# EasyEDA Pro project head_control.eprj, schematic Schematic2
Board Name: Board2; Create Date: 2025-11-11; Page Name: P1; Project Name: head_control; Schematic Name: Schematic2; Update Date: 2025-11-11; Company: 嘉立创EDA; Page Size: A4; Version: V1.0
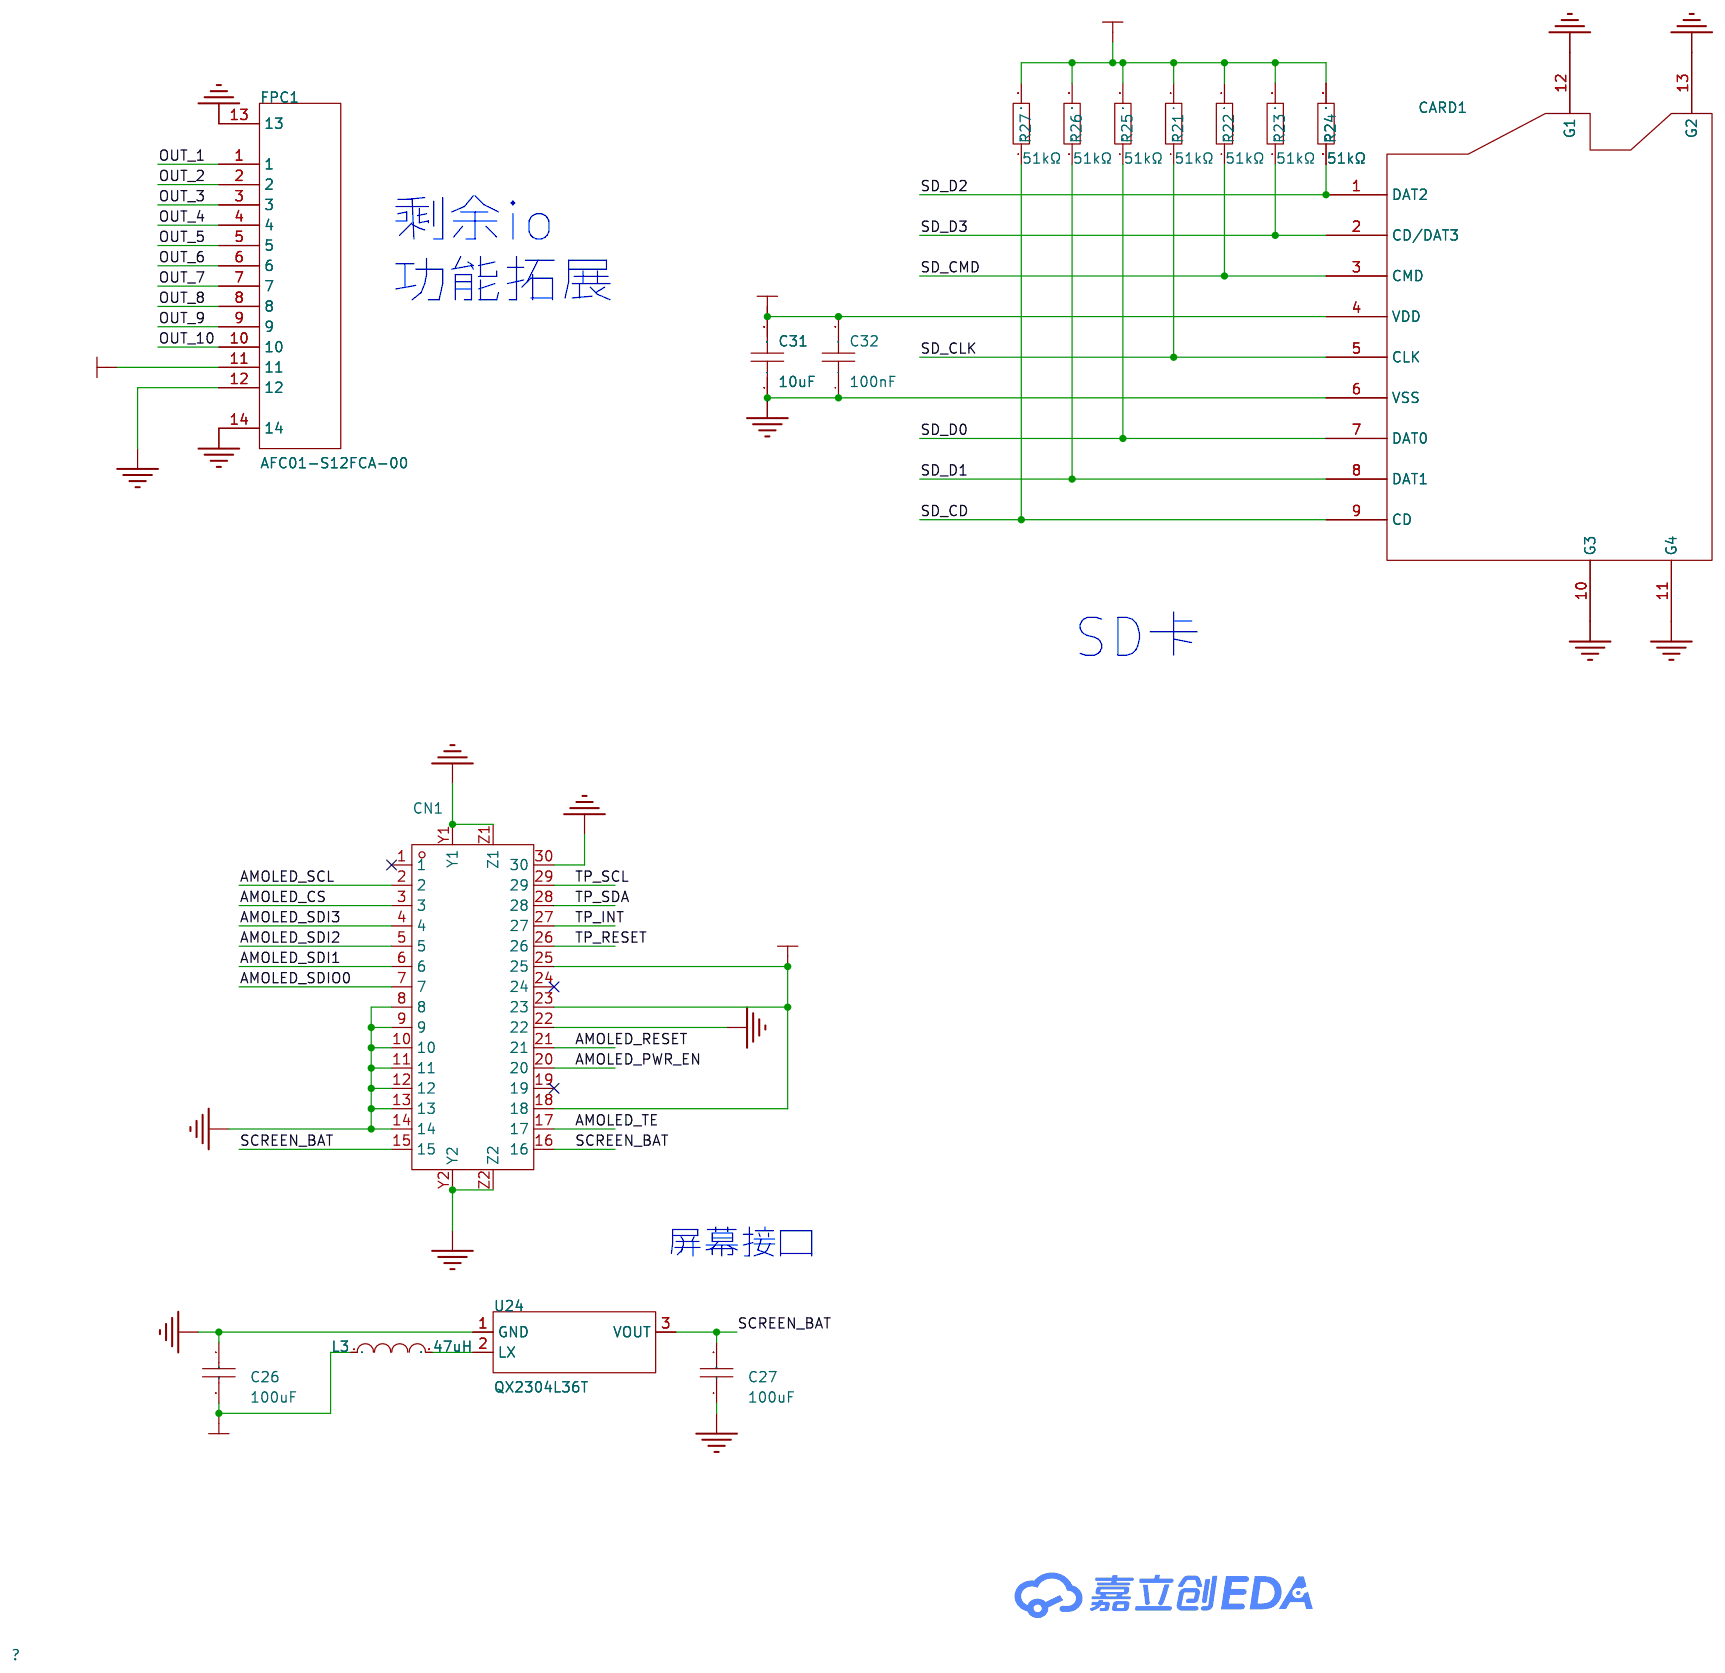
[diagram p1: schematic sheet]

## Parts
C26  100uF  [C0805]
C27  100uF  [C0805]
C31  10uF  [C0603]
C32  100nF  [C0603]
CARD1  TF-115Y-ACP9  [SIM-SMD_TF-115Y-BCP9]
CN1  AXE530127D  [CONN-SMD_30P-P0.40-AXE530127]
FPC1  AFC01-S12FCA-00  [FPC-SMD_AFC01-S12FCA-00]
L3  47uH  [IND-SMD_L4.0-W4.0_FNR40XXS]
R21  51kΩ  [R0603]
R22  51kΩ  [R0603]
R23  51kΩ  [R0603]
R24  51kΩ  [R0603]
R25  51kΩ  [R0603]
R26  51kΩ  [R0603]
R27  51kΩ  [R0603]
U24  QX2304L36T  [SOT-23-3_L2.9-W1.3-P1.90-LS2.4-BR]

## Library data of the parts
C26 C27 = GRM21BR60J107ME15L: LCSC Part Name: 100uF ±20% 6.3V; Supplier Part: C141660; Manufacturer: muRata(村田); Supplier Footprint: 0805; Datasheet: https://item.szlcsc.com/datasheet/GRM21BR60J107ME15L/152991.html; Supplier: LCSC; Tolerance: ±20%; Voltage Rating: 6.3V; Temperature Coefficient: X5R
C31 = CL10A106KP8NNNC: 容值:10uF;精度:±10%;额定电压:10V;材质(温度系数):X5R;; LCSC Part Name: 10uF ±10% 10V; Supplier Part: C19702; Manufacturer: SAMSUNG(三星); Supplier Footprint: 0603; JLCPCB Part Class: Basic Part; Datasheet: https://atta.szlcsc.com/upload/public/pdf/source/20160218/1457707763339.pdf; Supplier: LCSC; Tolerance: ±10%; Voltage Rated: 10V; Temperature Coefficient: X5R
C32 = CL10B104KB8NNNC: 容值:100nF;精度:±10%;额定电压:50V;材质(温度系数):X7R;; LCSC Part Name: 100nF ±10% 50V; Supplier Part: C1591; Manufacturer: SAMSUNG(三星); Supplier Footprint: 0603; JLCPCB Part Class: Extended Part; Datasheet: https://atta.szlcsc.com/upload/public/pdf/source/20160218/1457707763339.pdf; Supplier: LCSC; Tolerance: ±10%; Voltage Rated: 50V; Temperature Coefficient: X7R
CARD1 = TF-115Y-ACP9: 卡连接方式:自弹式;卡类型:MicroSD卡(TF卡);连接器类型:卡座;本体最大高度:-;工作温度范围:-25℃~+90℃;; LCSC Part Name: 自弹式 MicroSD卡(TF卡) 卡座; Supplier Part: C5454948; Manufacturer: XUNPU(讯普); Supplier Footprint: SMD; JLCPCB Part Class: Extended Part; Datasheet: https://atta.szlcsc.com/upload/public/pdf/source/20230427/4E99E1C1AE495F1492B014240EB95212.pdf; Supplier: LCSC; Card Connection Mode: 自弹式; Card Type: MicroSD卡(TF卡); Connector Type: 卡座; Additional Card Detection Pins: 有; Supplementary Features: 带定位柱; Operating Temperature Range: -25℃~+90℃
CN1 = AXE530127D: PIN总数:30P;间距:0.4mm;安装方式:立贴;排数:2;; LCSC Part Name: 间距:0.4mm PIN:30P 母 立贴; Supplier Part: C425103; Manufacturer: PANASONIC(松下); Supplier Footprint: SMD,P=0.4mm; JLCPCB Part Class: 扩展库; Datasheet: https://item.szlcsc.com/datasheet/AXE530127D/418588.html; Supplier: LCSC; Number of Pins: 30P; Pitch: 0.4mm; Mounting Type: 立贴; Number of Rows: 2
FPC1 = AFC01-S12FCA-00: LCSC Part Name: 间距:0.5mm P数:12P 翻盖式 下接; Supplier Part: C262661; Manufacturer: JS(钜硕电子); Supplier Footprint: SMD,P=0.5mm,卧贴; JLCPCB Part Class: 扩展库; Datasheet: https://item.szlcsc.com/datasheet/AFC01-S12FCA-00/253920.html; Supplier: LCSC; Locking Feature: 翻盖式; Contact Type: 下接; Number of Contacts: 12P; Pitch: 0.5mm; Mounting Type: 卧贴; FFC, FCB Thickness: 0.3mm; Height Above Board: 2mm
L3 = FNR4030S470MT: LCSC Part Name: 47uH ±20% 1A; Supplier Part: C167888; Manufacturer: cjiang(长江微电); Supplier Footprint: SMD,4x4mm; JLCPCB Part Class: 扩展库; Datasheet: https://atta.szlcsc.com/upload/public/pdf/source/20190327/C167925_9EFF0AABC4CA629C2CC95961DBF7D39D.pdf; Supplier: LCSC; Tolerance: ±20%; Current Rating: 800mA; Current - Saturation(Isat): 1A; DC Resistance(DCR): 579mΩ; Type: 磁胶屏蔽绕线合金电感
R21-R27 = RC0603FR-0751KL: 电阻类型:厚膜电阻;阻值:51kΩ;精度:±1%;功率:100mW;工作电压:75V;温度系数:±100ppm/℃;; LCSC Part Name: 厚膜电阻 51kΩ ±1% 100mW; Supplier Part: C107231; Manufacturer: YAGEO(国巨); Supplier Footprint: 0603; JLCPCB Part Class: 扩展库; Datasheet: https://atta.szlcsc.com/upload/public/pdf/source/20180821/C275644_0D56F95EFF785E7D9A1FEF436B37DA78.pdf; Supplier: LCSC; Type: 厚膜电阻; Tolerance: ±1%; Power(Watts): 100mW; Voltage-Supply(Max): 75V; Temperature Coefficient: ±100ppm/℃; Operating Temperature: -55℃~+155℃
U24 = QX2304L36T: LCSC Part Name: 高效 PFM 同步升压 DC/DC 变换器; Supplier Part: C219041; Manufacturer: 泉芯; Supplier Footprint: SOT-23; JLCPCB Part Class: 扩展库; Datasheet: https://item.szlcsc.com/datasheet/QX2304L36T/219906.html; Supplier: LCSC; Function: 升压型; Output Type: 固定; Voltage - Supply: 900mV~3.6V; Output Voltage: 3.6V; Output Current: 800mA; Frequency - Switching: 300kHz; Operating Temperature: -20℃~+85℃@(TA); Synchronous Rectifier: 是; Number of Outputs: 1; Topology: 升压式; Quiescent Current: 15uA; Switch tube (built-in/external): 内置

## Nets
3V3: C26.1 C31.2 C32.2 CARD1.4(VDD) CN1.18 CN1.23 CN1.25 FPC1.11 L3.1 R21.2 R22.2 R23.2 R24.2 R25.2 R26.2 R27.2
GND: C26.2 C27.1 C31.1 C32.1 CARD1.6(VSS) CARD1.10(G3) CARD1.11(G4) CARD1.12(G1) CARD1.13(G2) CN1.8 CN1.9 CN1.10 CN1.11 CN1.12 CN1.13 CN1.14 CN1.22 CN1.30 CN1.Y1 CN1.Y2 CN1.Z1 CN1.Z2 FPC1.12 FPC1.13 FPC1.14 U24.1(GND)
AMOLED_CS: CN1.3
AMOLED_PWR_EN: CN1.20
AMOLED_RESET: CN1.21
AMOLED_SCL: CN1.2
AMOLED_SDI1: CN1.6
AMOLED_SDI2: CN1.5
AMOLED_SDI3: CN1.4
AMOLED_SDIO0: CN1.7
AMOLED_TE: CN1.17
OUT_1: FPC1.1
OUT_2: FPC1.2
OUT_3: FPC1.3
OUT_4: FPC1.4
OUT_5: FPC1.5
OUT_6: FPC1.6
OUT_7: FPC1.7
OUT_8: FPC1.8
OUT_9: FPC1.9
OUT_10: FPC1.10
SCREEN_BAT: C27.2 CN1.15 CN1.16 U24.3(VOUT)
SD_CD: CARD1.9(CD) R27.1
SD_CLK: CARD1.5(CLK) R21.1
SD_CMD: CARD1.3(CMD) R22.1
SD_D0: CARD1.7(DAT0) R25.1
SD_D1: CARD1.8(DAT1) R26.1
SD_D2: CARD1.1(DAT2) R24.1
SD_D3: CARD1.2(CD/DAT3) R23.1
TP_INT: CN1.27
TP_RESET: CN1.26
TP_SCL: CN1.29
TP_SDA: CN1.28
Net-(L3-2): L3.2 U24.2(LX)

Not connected (* = marked no-connect by the designer): CN1 1* 19* 24*

## Notes on the sheet
- 剩余io
  功能拓展
- SD卡
- 屏幕接口
